# EAGLE design project_02 (EAGLE 9.6.0)
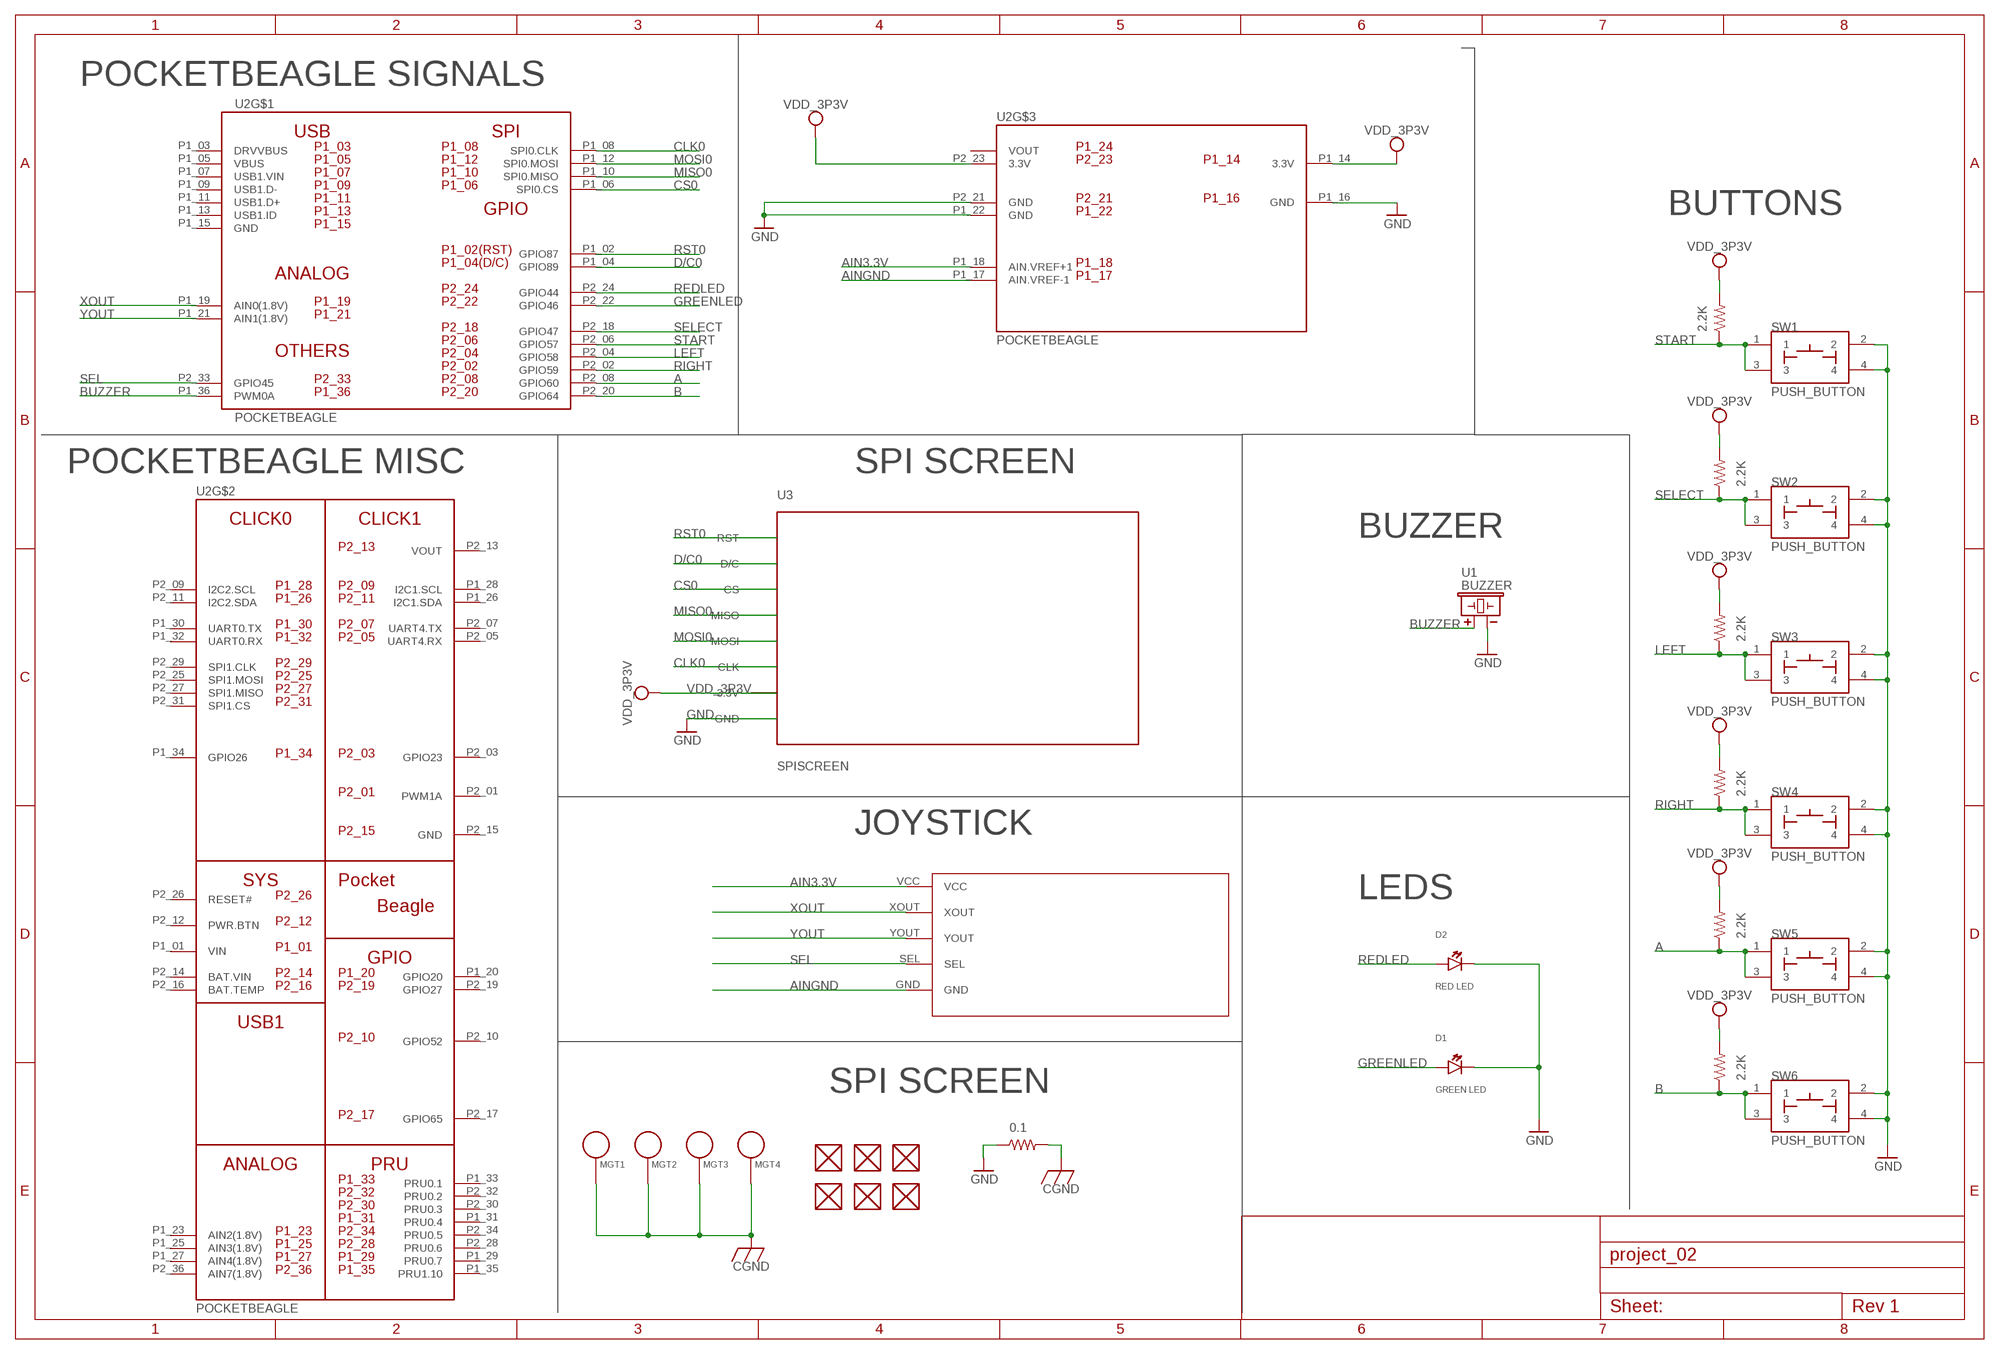
[diagram p0: schematic, sheet 1]

## Parts
2.2K  2.2K  R_R0402  [R0402]
D1  GREEN LED  LED2  [EIA-STD]
D2  RED LED  LED2  [EIA-STD]
FUD1  FIDUCIAL  [FIDUCIAL_40MIL]
FUD2  FIDUCIAL  [FIDUCIAL_40MIL]
FUD3  FIDUCIAL  [FIDUCIAL_40MIL]
FUD4  FIDUCIAL  [FIDUCIAL_40MIL]
FUD5  FIDUCIAL  [FIDUCIAL_40MIL]
FUD6  FIDUCIAL  [FIDUCIAL_40MIL]
MGT1  MOUNTING_HOLE  [MOUNTING_HOLE]
MGT2  MOUNTING_HOLE  [MOUNTING_HOLE]
MGT3  MOUNTING_HOLE  [MOUNTING_HOLE]
MGT4  MOUNTING_HOLE  [MOUNTING_HOLE]
R1  0.1  R_R0402  [R0402]
R3  2.2K  R_R0402  [R0402]
R4  2.2K  R_R0402  [R0402]
R5  2.2K  R_R0402  [R0402]
R6  2.2K  R_R0402  [R0402]
R7  2.2K  R_R0402  [R0402]
SW1  PUSH_BUTTON  [BUTTON_12.5MM]
SW2  PUSH_BUTTON  [BUTTON_12.5MM]
SW3  PUSH_BUTTON  [BUTTON_12.5MM]
SW4  PUSH_BUTTON  [BUTTON_12.5MM]
SW5  PUSH_BUTTON  [BUTTON_12.5MM]
SW6  PUSH_BUTTON  [BUTTON_12.5MM]
U1  BUZZER  [BUZZER_6.5MM]
U2  POCKETBEAGLE  [POCKETBEAGLE]
U3  SPISCREEN  [SCREEN]
U$1  JOYSTICK2  [JOYSTICK2]

## Nets
A: R6.1 SW5.1 SW5.3 U2.P2_08(GPIO60)
AIN3.3V: U2.P1_18(AIN.VREF+1) U$1.VCC
AINGND: U2.P1_17(AIN.VREF-1) U$1.GND
B: R7.1 SW6.1 SW6.3 U2.P2_20(GPIO64)
BUZZER: U1.+ U2.P1_36(PWM0A)
CGND: MGT1.P$1 MGT2.P$1 MGT3.P$1 MGT4.P$1 R1.2
CLK0: U2.P1_08(SPI0.CLK) U3.CLK
CS0: U2.P1_06(SPI0.CS) U3.CS
D/C0: U2.P1_04(GPIO89) U3.D/C
GND: D1.CATHODE D2.CATHODE R1.1 SW1.2 SW1.4 SW2.2 SW2.4 SW3.2 SW3.4 SW4.2 SW4.4 SW5.2 SW5.4 SW6.2 SW6.4 U1.- U2.P1_16(GND) U2.P1_22(GND) U2.P2_21(GND) U3.GND
GREENLED: D1.ANODE U2.P2_22(GPIO46)
LEFT: R4.1 SW3.1 SW3.3 U2.P2_04(GPIO58)
MISO0: U2.P1_10(SPI0.MISO) U3.MISO
MOSI0: U2.P1_12(SPI0.MOSI) U3.MOSI
REDLED: D2.ANODE U2.P2_24(GPIO44)
RIGHT: R5.1 SW4.1 SW4.3 U2.P2_02(GPIO59)
RST0: U2.P1_02(GPIO87) U3.RST
SEL: U2.P2_33(GPIO45) U$1.SEL
SELECT: R3.1 SW2.1 SW2.3 U2.P2_18(GPIO47)
START: 2.2K.1 SW1.1 SW1.3 U2.P2_06(GPIO57)
VDD_3P3V: 2.2K.2 R3.2 R4.2 R5.2 R6.2 R7.2 U2.P1_14(3.3V) U2.P2_23(3.3V) U3.3.3V
XOUT: U2.P1_19(AIN0(1.8V)) U$1.XOUT
YOUT: U2.P1_21(AIN1(1.8V)) U$1.YOUT
Unconnected: FUD1.P$1 FUD2.P$1 FUD3.P$1 FUD4.P$1 FUD5.P$1 FUD6.P$1 U2.P1_03(DRVVBUS) U2.P1_05(VBUS) U2.P1_07(USB1.VIN) U2.P1_09(USB1.D-) U2.P1_11(USB1.D+) U2.P1_13(USB1.ID) U2.P1_15(GND) U2.P1_20(GPIO20) U2.P1_23(AIN2(1.8V)) U2.P1_25(AIN3(1.8V)) U2.P1_26(I2C1.SDA) U2.P1_27(AIN4(1.8V)) U2.P1_28(I2C1.SCL) U2.P1_29(PRU0.7) U2.P1_30(UART0.TX) U2.P1_31(PRU0.4) U2.P1_32(UART0.RX) U2.P1_33(PRU0.1) U2.P1_34(GPIO26) U2.P1_35(PRU1.10) U2.P2_01(PWM1A) U2.P2_03(GPIO23) U2.P2_05(UART4.RX) U2.P2_07(UART4.TX) U2.P2_09(I2C2.SCL) U2.P2_10(GPIO52) U2.P2_11(I2C2.SDA) U2.P2_12(PWR.BTN) U2.P2_16(BAT.TEMP) U2.P2_17(GPIO65) U2.P2_19(GPIO27) U2.P2_25(SPI1.MOSI) U2.P2_26(RESET#) U2.P2_27(SPI1.MISO) U2.P2_28(PRU0.6) U2.P2_29(SPI1.CLK) U2.P2_30(PRU0.3) U2.P2_31(SPI1.CS) U2.P2_32(PRU0.2) U2.P2_34(PRU0.5) U2.P2_36(AIN7(1.8V))

## Notes on the sheet
- POCKETBEAGLE SIGNALS
- BUTTONS
- POCKETBEAGLE MISC | SPI SCREEN
- BUZZER
- JOYSTICK
- LEDS
- SPI SCREEN

## Power pins joined to a net without a drawn wire
BAT.VIN: U2.P2_14(BAT.VIN)
GND: U2.P2_15(GND)
VIN: U2.P1_01(VIN)
VOUT: U2.P1_24(VOUT) U2.P2_13(VOUT)

## Library data of the parts
2.2K R1 R3-R7 = project_02:R_: RESISTOR, American symbol
D1 D2 = project_02:LED2: EIA-STD LED, LTST-C191TBKT
FUD1-FUD6 = PocketBeagle:FIDUCIAL
MGT1-MGT4 = project_02:MOUNTING_HOLE: Chassis Mounting Hole w/GND connection ability
SW1-SW6 = project_02:PUSH_BUTTON
U1 = project_02:BUZZER: CEM-1203 Buzzer
U2 = project_02:POCKETBEAGLE
U3 = project_02:SPISCREEN
U$1 = project_02:JOYSTICK2

## Board
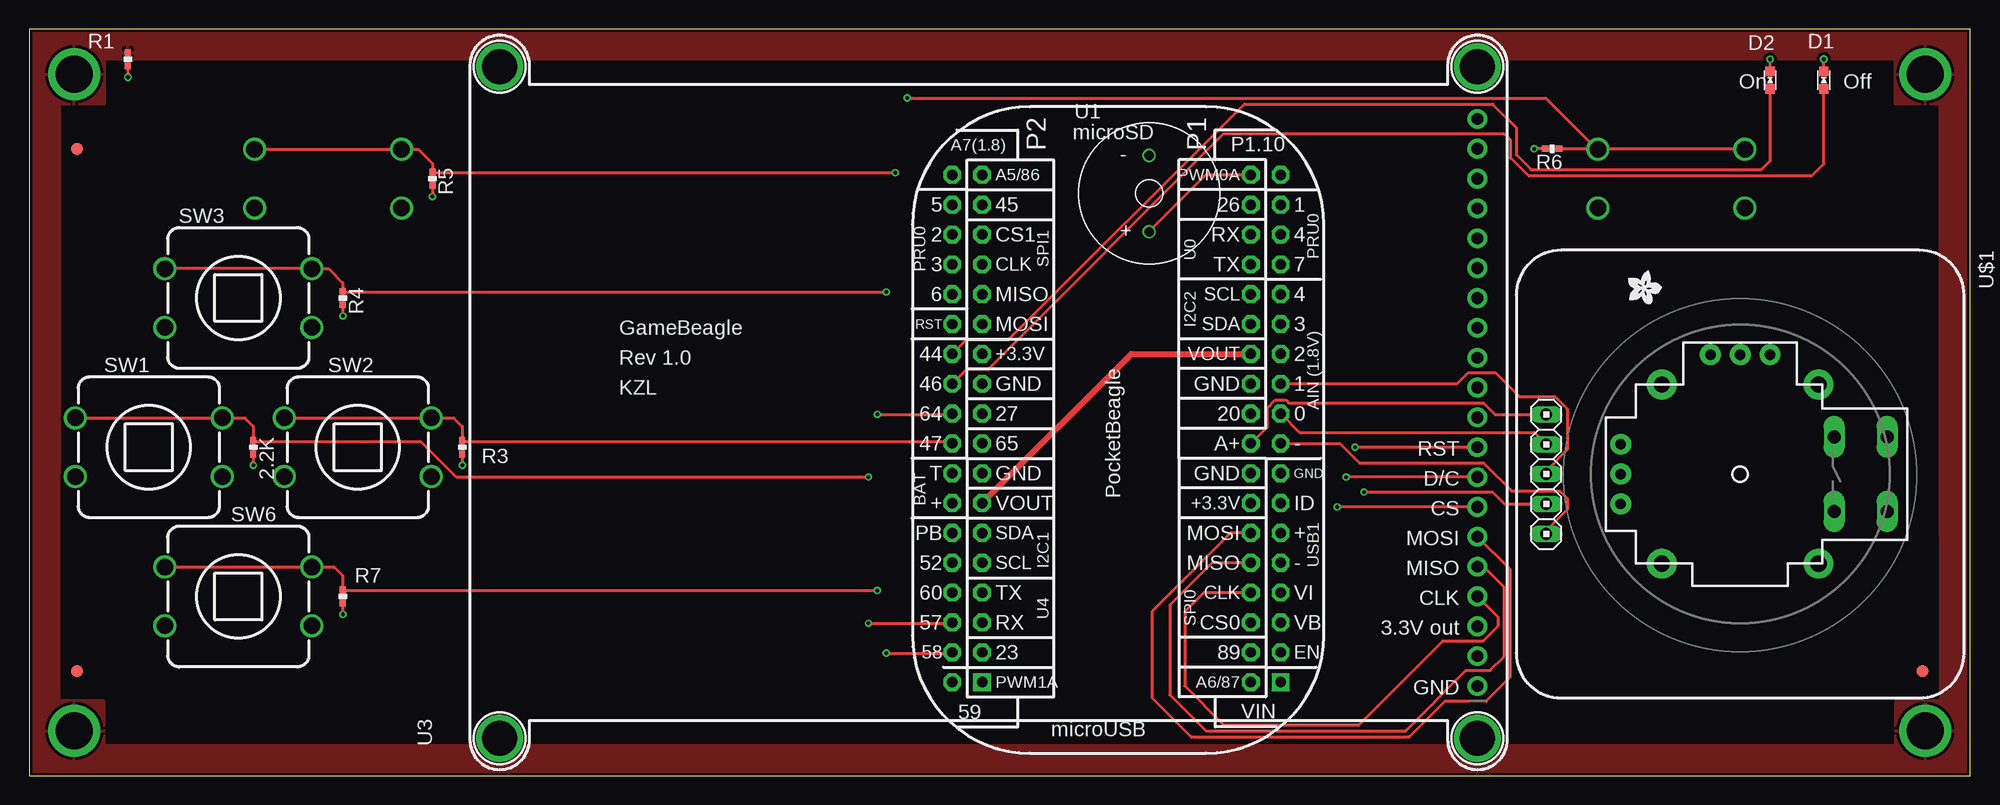
[diagram p1: board, top side]
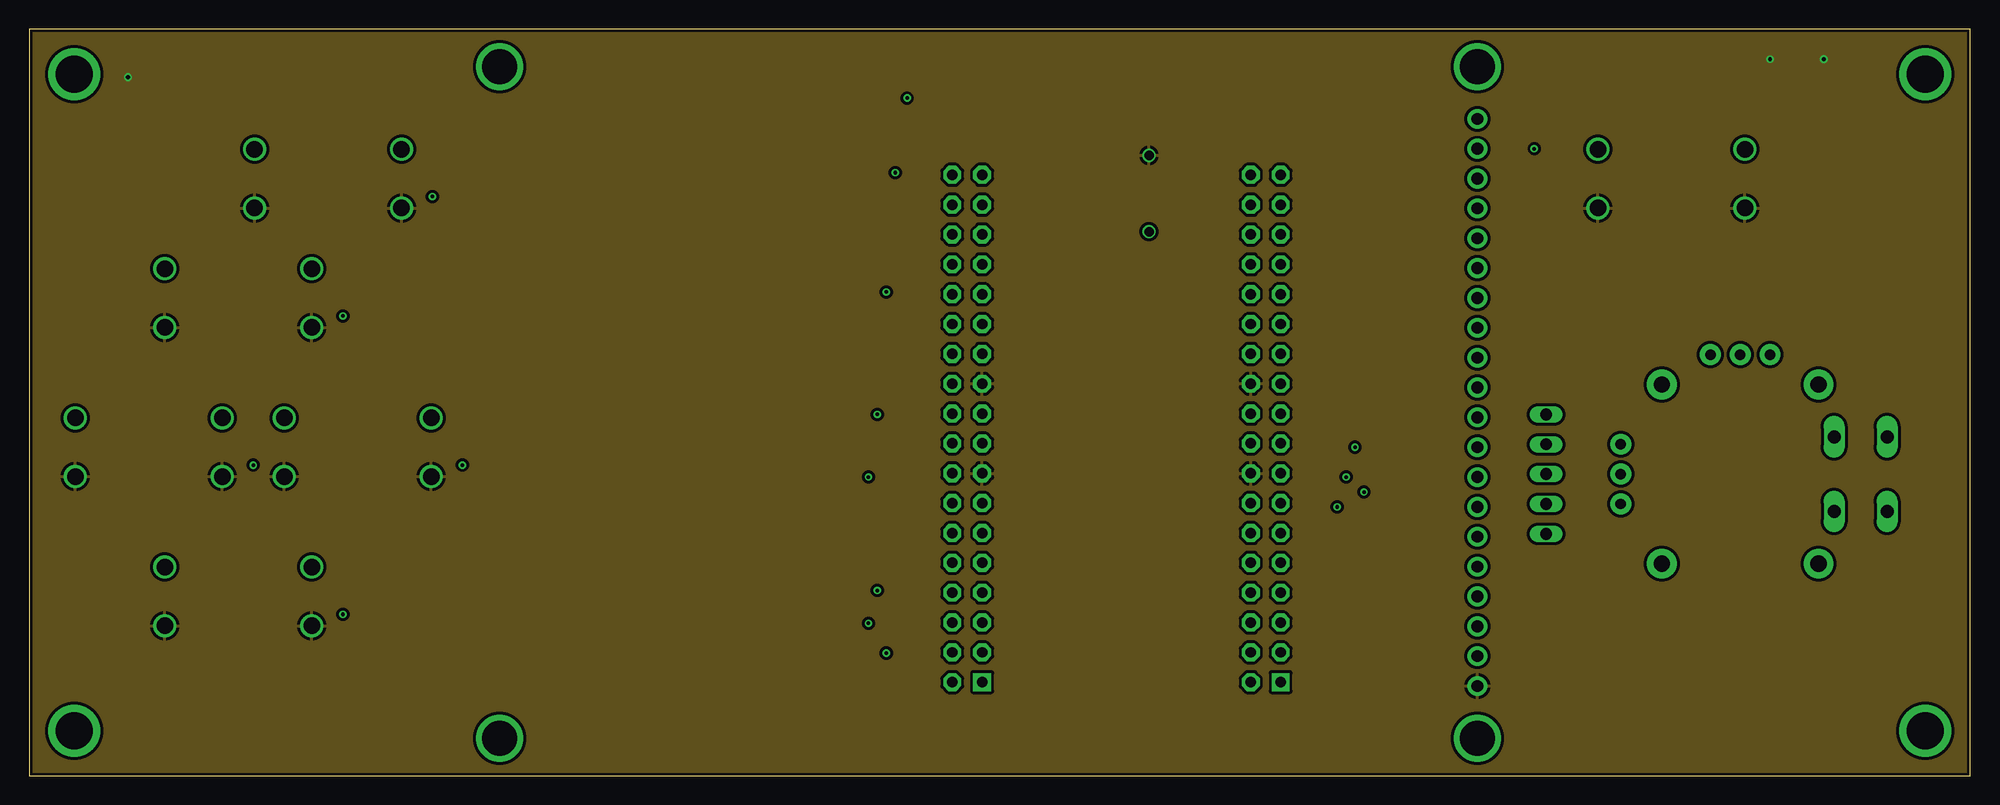
[diagram p2: board, inner layer Route2]
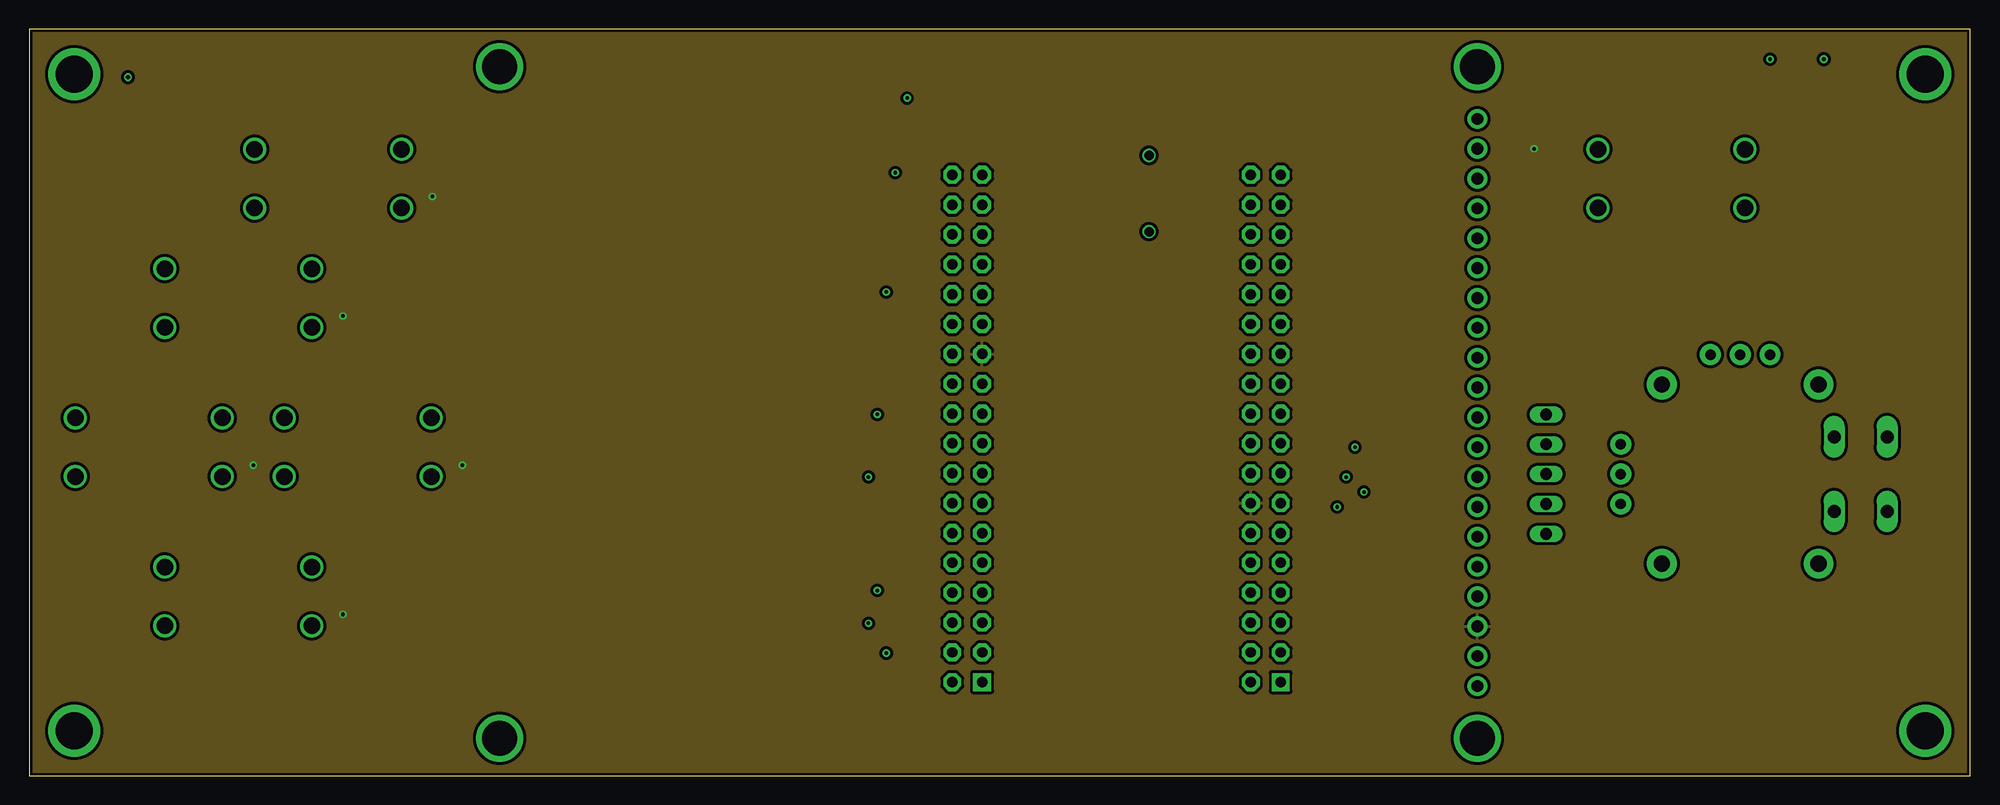
[diagram p3: board, inner layer Route15]
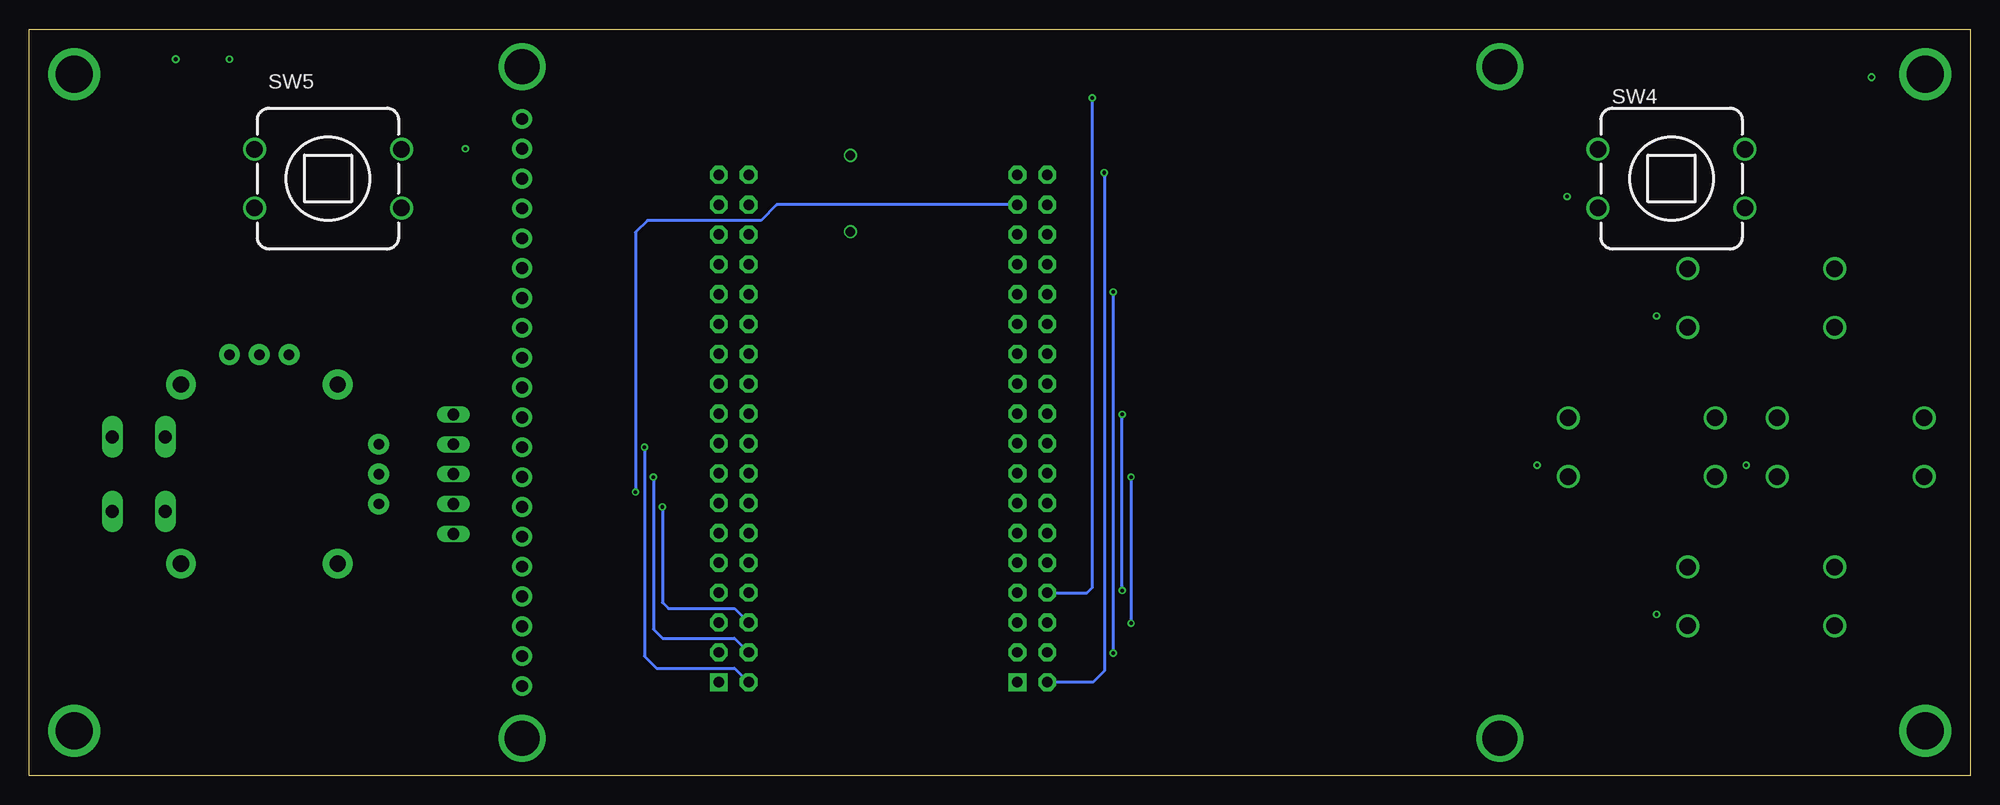
[diagram p4: board, bottom side, seen from below]

Size 165.1 x 63.5 mm. Coordinates in mm from the lower left corner, seen from the top.
Outline: 0,0 165.1,0 165.1,63.5 0,63.5 0,0
Copper layers (1*2*15*16): Top 0.035mm / dielectric 0.23mm / Route2 0.035mm / dielectric 0.93mm / Route15 0.035mm / dielectric 0.23mm / Bottom 0.035mm
Design rules "ENGI301_4lyr": minimum track width 10mil, minimum drill 12mil, track to track 10mil, track to pad 10mil, pad to pad 10mil, via to via 10mil, smd to smd 10mil, copper to edge 10mil, drill to drill 12mil, minimum pad ring 6mil, minimum via ring 6mil, stop-mask expansion 3mil, vias tented up to drill 25mil, thermal gap 10mil

### Footprints (pad centres in the part's own frame; a part is rotated, then mirrored left to right if it is on the bottom)
R0402 = smd 0.61 x 0.508: 1 -0.559,0; 2 0.559,0
EIA-STD = smd 0.8 x 0.8: ANODE -0.75,0; CATHODE 0.75,0
FIDUCIAL_40MIL = smd 1.016 x 1.016: P$1 0,0
MOUNTING_HOLE = drill 3.175 pad 4.445: P$1 0,0
BUTTON_12.5MM = drill 1.4: 1 -6.25,2.5; 2 -6.25,-2.5; 3 6.25,2.5; 4 6.25,-2.5
BUZZER_6.5MM = drill 0.8: + 0,-3.25; - 0,3.25
POCKETBEAGLE = drill 0.889 pad 1.524 square: P1_01 5.91,3.53; P2_01 5.91,28.93 | drill 0.889 pad 1.524 octagon: P1_02 5.91,6.07; P1_03 8.45,3.53; P1_04 8.45,6.07; P1_05 10.99,3.53; P1_06 10.99,6.07; P1_07 13.53,3.53; P1_08 13.53,6.07; P1_09 16.07,3.53; P1_10 16.07,6.07; P1_11 18.61,3.53; P1_12 18.61,6.07; P1_13 21.15,3.53; P1_14 21.15,6.07; P1_15 23.69,3.53; P1_16 23.69,6.07; P1_17 26.23,3.53; P1_18 26.23,6.07; P1_19 28.77,3.53; P1_20 28.77,6.07; P1_21 31.31,3.53; P1_22 31.31,6.07; P1_23 33.85,3.53; P1_24 33.85,6.07; P1_25 36.39,3.53; P1_26 36.39,6.07; P1_27 38.93,3.53; P1_28 38.93,6.07; P1_29 41.47,3.53; P1_30 41.47,6.07; P1_31 44.01,3.53; P1_32 44.01,6.07; P1_33 46.55,3.53; P1_34 46.55,6.07; P1_35 49.09,3.53; P1_36 49.09,6.07; P2_02 5.91,31.47; P2_03 8.45,28.93; P2_04 8.45,31.47; P2_05 10.99,28.93; P2_06 10.99,31.47; P2_07 13.53,28.93; P2_08 13.53,31.47; P2_09 16.07,28.93; P2_10 16.07,31.47; P2_11 18.61,28.93; P2_12 18.61,31.47; P2_13 21.15,28.93; P2_14 21.15,31.47; P2_15 23.69,28.93; P2_16 23.69,31.47; P2_17 26.23,28.93; P2_18 26.23,31.47; P2_19 28.77,28.93; P2_20 28.77,31.47; P2_21 31.31,28.93; P2_22 31.31,31.47; P2_23 33.85,28.93; P2_24 33.85,31.47; P2_25 36.39,28.93; P2_26 36.39,31.47; P2_27 38.93,28.93; P2_28 38.93,31.47; P2_29 41.47,28.93; P2_30 41.47,31.47; P2_31 44.01,28.93; P2_32 44.01,31.47; P2_33 46.55,28.93; P2_34 46.55,31.47; P2_35 49.09,28.93; P2_36 49.09,31.47
SCREEN = drill 1 pad 1.676: 2@JP2 -21.59,-40.64; 3.3V -19.05,-40.64; 10@JP2 -1.27,-40.64; 11@JP2 1.27,-40.64; 12@JP2 3.81,-40.64; 13@JP2 6.35,-40.64; 14@JP2 8.89,-40.64; 15@JP2 11.43,-40.64; 16@JP2 13.97,-40.64; 17@JP2 16.51,-40.64; 18@JP2 19.05,-40.64; 19@JP2 21.59,-40.64; 20@JP2 24.13,-40.64; CLK -16.51,-40.64; CS -8.89,-40.64; D/C -6.35,-40.64; GND -24.13,-40.64; MISO -13.97,-40.64; MOSI -11.43,-40.64; RST -3.81,-40.64 | drill 3 pad 3.6: P$1@U$7 -28.575,-40.64; P$1@U$15 28.575,-40.64; P$1@U$16 -28.575,42.545; P$1@U$17 28.575,42.545
JOYSTICK2 = drill 1.1 pad 1.778 long: B1A@U1 15.875,31.551; B1B@U1 22.225,31.551; B2A@U1 15.875,27.051; B2B@U1 22.225,27.051 | drill 1.016 long: GND 24.13,2.54; SEL 21.59,2.54; VCC 13.97,2.54; XOUT 16.51,2.54; YOUT 19.05,2.54 | drill 0.889 pad 1.778: H1@U1 16.51,8.89; H2@U1 19.05,8.89; H3@U1 21.59,8.89; V1@U1 8.89,21.59; V2@U1 8.89,19.05; V3@U1 8.89,16.51 | drill 1.397 pad 2.54: MOUNT1@U1 11.43,25.718; MOUNT2@U1 11.43,12.383; MOUNT3@U1 26.67,12.383; MOUNT4@U1 26.67,25.718

### Placement (x,y rotation side)
2.2K  19.05,27.94 270 top
D1  152.65,59.18 90 top
D2  148.08,59.18 90 top
FUD1  161.04,8.89 0 top
FUD2  4.06,8.89 0 top
FUD3  4.06,53.34 0 top
FUD4  161.04,8.89 0 top
FUD5  4.06,8.89 0 top
FUD6  4.06,53.34 0 top
MGT1  161.29,59.69 0 top
MGT2  3.81,59.69 0 top
MGT3  161.29,3.81 0 top
MGT4  3.81,3.81 0 top
R1  8.38,60.96 90 top
R3  36.83,27.94 270 top
R4  26.67,40.64 270 top
R5  34.29,50.8 270 top
R6  129.54,53.34 180 top
R7  26.67,15.24 270 top
SW1  10.16,27.94 0 top
SW2  27.94,27.94 0 top
SW3  17.78,40.64 0 top
SW4  25.4,50.8 0 bottom
SW5  139.7,50.8 0 bottom
SW6  17.78,15.24 0 top
U1  95.25,49.53 0 top
U2  109.98,2.03 90 top
U3  82.55,31.75 90 top
U$1  126.49,44.7 270 top

### Tracks (layer width: path | path; a pad name or v marks a point on that pad's centre or on a via)
A  (via drill 0.3 pad 0.61)
  Top 0.254: SW5.1 SW5.3 133.35,53.3 | 133.35,53.3 128.99,57.66 v74.68,57.66 | R6.1 130.14,53.3 133.35,53.3
  Bottom 0.254: U2.P2_08 75.12,15.56 74.68,16 v74.68,57.66
AIN3.3V
  Top 0.254: U2.P1_18 105.31,29.66 105.31,31.27 105.98,31.95 106.92,31.95 107.17,31.7 123.69,31.7 124.66,30.73 U$1.VCC
AINGND
  Top 0.254: U2.P1_17 111.48,28.26 113.13,26.62 123.69,26.62 126.11,24.21 130.2,24.21 130.84,23.57 130.84,22.66 129.03,20.86 U$1.GND
B  (via drill 0.3 pad 0.61)
  Top 0.254: SW6.1 SW6.3 25.95,17.74 26.67,17.02 R7.1 26.72,15.75 v72.14,15.75 | v72.14,30.73 78.44,30.73 U2.P2_20
  Bottom 0.254: v72.14,15.75 v72.14,30.73
BUZZER
  Top 0.254: U1.+ 100.09,51.12 U2.P1_36
CGND
  pour Top: -1.27,25.4 -1.27,-1.27 166.37,-1.27 166.37,20.32 162.56,20.32 162.56,6.35 158.75,6.35 158.75,2.54 6.35,2.54 6.35,6.35 2.54,6.35 2.54,25.4
  pour Top: -1.27,25.4 -1.27,64.77 166.37,64.77 166.37,20.32 162.56,20.32 162.56,57.15 158.75,57.15 158.75,60.96 6.35,60.96 6.35,57.15 2.54,57.15 2.54,25.4
CLK0
  Top 0.254: U3.CLK 124.97,13.46 124.97,12.75 123.69,11.48 120.25,11.48 113.08,4.32 101.6,4.32 98.3,7.62 98.3,13.97 99.89,15.56 U2.P1_08
CS0  (via drill 0.3 pad 0.61)
  Top 0.254: U3.CS v111.25,22.86
  Bottom 0.254: v111.25,22.86 111.25,14.73 110.74,14.22 105.11,14.22 U2.P1_06
D/C0  (via drill 0.3 pad 0.61)
  Top 0.254: U3.D/C v112.01,25.4
  Bottom 0.254: v112.01,25.4 112.01,12.45 111.25,11.68 105.11,11.68 U2.P1_04
GND  (via drill 0.3 pad 0.61, 0.35)
  Top 0.254: D2.CATHODE v148.08,60.96 | D1.CATHODE v152.65,60.96 | R1.1 v8.38,59.44
  pour Route2: -2.54,66.04 -2.54,-2.54 167.64,-2.54 167.64,66.04
GREENLED
  Top 0.254: U2.P2_22 79.71,34.54 81.53,34.54 101.6,54.61 125.48,54.61 125.98,54.1 125.98,52.58 127.51,51.05 151.64,51.05 152.65,52.07 D1.ANODE
LEFT  (via drill 0.3 pad 0.61)
  Top 0.254: SW3.1 11.57,43.18 23.99,43.18 SW3.3 25.44,43.14 26.67,41.91 R4.1 26.72,41.15 v72.9,41.15 | v72.9,10.41 78.44,10.41 U2.P2_04
  Bottom 0.254: v72.9,41.15 v72.9,10.41
MISO0
  Top 0.254: U2.P1_10 100.61,18.1 97.03,14.52 97.03,6.86 100.08,3.81 117.09,3.81 122.22,8.94 124.26,8.94 125.48,10.16 125.48,16 123.7,17.78 U3.MISO
MOSI0
  Top 0.254: U2.P1_12 102.18,20.64 95.5,13.97 95.5,6.6 98.81,3.3 117.4,3.3 120.45,6.35 123.95,6.35 125.98,8.38 125.98,17.53 U3.MOSI
REDLED
  Top 0.254: U2.P2_24 79.71,37.08 83.31,37.08 103.38,57.15 124.46,57.15 126.49,55.12 126.49,52.83 127.76,51.56 147.32,51.56 148.08,52.32 D2.ANODE
RIGHT  (via drill 0.3 pad 0.61)
  Top 0.254: SW4.3 SW4.1 33.06,53.3 34.29,52.07 R5.1 34.34,51.31 v73.66,51.31
  Bottom 0.254: v73.66,51.31 73.66,8.89 74.61,7.94 U2.P2_02
RST0  (via drill 0.3 pad 0.61)
  Top 0.254: U3.RST v112.78,27.94
  Bottom 0.254: v112.78,27.94 112.78,10.16 111.76,9.14 105.11,9.14 U2.P1_02
SEL  (via drill 0.3 pad 0.61)
  Top 0.254: v113.54,24.13 124.46,24.13 125.48,23.11 U$1.SEL
  Bottom 0.254: U2.P2_33 101.53,48.58 102.87,47.24 112.52,47.24 113.54,46.23 v113.54,24.13
SELECT
  Top 0.254: SW2.1 SW2.3 36.11,30.44 36.83,29.72 R3.1 36.88,28.45 78.33,28.45 U2.P2_18
START  (via drill 0.3 pad 0.61)
  Top 0.254: SW1.1 SW1.3 18.33,30.44 19.05,29.72 2.2K.1 19.1,28.45 33.27,28.45 36.32,25.4 v71.37,25.4 | v71.37,12.95 78.44,12.95 U2.P2_06
  Bottom 0.254: v71.37,25.4 v71.37,12.95
VDD_3P3V  (via drill 0.3 pad 0.61)
  Top 0.254: R5.2 v34.29,49.28 | R4.2 v26.67,39.12 | 2.2K.2 v19.05,26.42 | R3.2 v36.83,26.42 | R7.2 v26.67,13.72 | R6.2 v128.02,53.34
  pour Route15: -5.08,68.58 -5.08,-5.08 170.18,-5.08 170.18,68.58
VOUT
  Top 0.508: U2.P2_13 93.75,35.88 U2.P1_24
XOUT
  Top 0.254: U2.P1_19 108.04,29.21 128.02,29.21 U$1.XOUT
YOUT
  Top 0.254: U2.P1_21 121.48,33.34 122.43,34.29 124.71,34.29 126.75,32.26 129.76,32.26 130.84,31.19 130.84,27.74 129.03,25.94 U$1.YOUT

### Text on the board
tPlace: On | Off | GameBeagle | Rev 1.0 | KZL